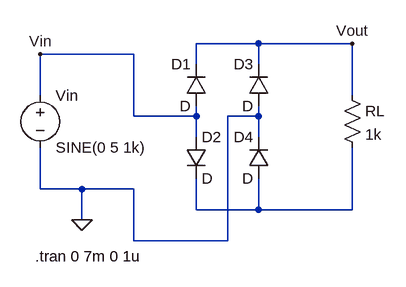
[diagram p0: schematic exp1.asc]
exp1.asc, the LTspice schematic file:
Version 4
SHEET 1 880 680
WIRE 208 32 112 32
WIRE 352 32 208 32
WIRE 16 48 -128 48
WIRE 112 64 112 32
WIRE 208 64 208 32
WIRE -128 112 -128 48
WIRE 352 112 352 32
WIRE 16 144 16 48
WIRE 112 144 112 128
WIRE 112 144 16 144
WIRE 208 144 208 128
WIRE 208 144 160 144
WIRE 112 176 112 144
WIRE 208 176 208 144
WIRE -128 256 -128 192
WIRE -64 256 -128 256
WIRE 16 256 -64 256
WIRE 112 288 112 240
WIRE 208 288 208 240
WIRE 208 288 112 288
WIRE 352 288 352 192
WIRE 352 288 208 288
WIRE -64 304 -64 256
WIRE 16 336 16 256
WIRE 160 336 160 144
WIRE 160 336 16 336
FLAG -64 304 0
FLAG -128 48 Vin
FLAG 352 32 Vout
SYMBOL diode 128 128 R180
WINDOW 0 24 64 Left 2
WINDOW 3 24 0 Left 2
SYMATTR InstName D1
SYMBOL diode 224 128 R180
WINDOW 0 24 64 Left 2
WINDOW 3 24 0 Left 2
SYMATTR InstName D3
SYMBOL diode 224 240 R180
WINDOW 0 24 64 Left 2
WINDOW 3 24 0 Left 2
SYMATTR InstName D4
SYMBOL voltage -128 96 R0
WINDOW 123 0 0 Left 0
WINDOW 39 0 0 Left 0
SYMATTR InstName Vin
SYMATTR Value SINE(0 5 1k)
SYMBOL res 336 96 R0
SYMATTR InstName RL
SYMATTR Value 1k
SYMBOL diode 96 176 R0
SYMATTR InstName D2
TEXT -136 360 Left 2 !.tran 0 7m 0 1u

The netlist it stands for:
* exp1.asc
D1 Vin Vout D
D3 0 Vout D
D4 N001 0 D
Vin Vin 0 SINE(0 5 1k)
RL Vout N001 1k
D2 Vin N001 D
.model D D
.lib standard.dio
.tran 0 7m 0 1u
.backanno
.end